# Altium project Flyback-Converter.PrjPcb
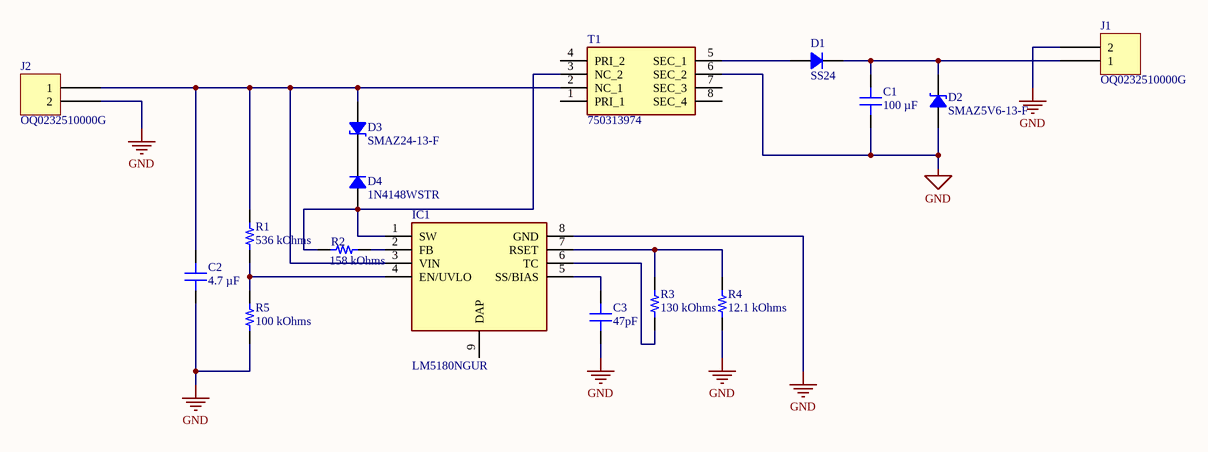
[diagram p0: Flyback-Converter_sch.SchDoc]
1 sheet, 16 parts. Net scope: global (net labels, ports and power ports of the same name join across sheets).
Board file: Flyback-Converter_pcb.PcbDoc

## Sheet Flyback-Converter_sch.SchDoc
size A4; SheetNumber: 1; SheetTotal: 1

### Parts
C1  100 µF  [CAP 1210_3225 - 1MM]
C2  4.7 µF  [CAP 1210_3225 - 1MM]
C3  47pF  [CAP 0402_1005]
D1  SS24  [DO214AA SMB]
D2  SMAZ5V6-13-F  [DO214AC SMA]
D3  SMAZ24-13-F  [DO214AC SMA]
D4  1N4148WSTR  [SOD323F]
IC1  LM5180NGUR  [SON80P400X400X80-9N]
J1  OQ0232510000G  [FCI 06-381-2PIN]
J2  OQ0232510000G  [FCI 06-381-2PIN]
R1  536 kOhms  [RES 0603_1608]
R2  158 kOhms  [RES 0402_1005]
R3  130 kOhms  [RES 0402_1005]
R4  12.1 kOhms  [RES 0402_1005]
R5  100 kOhms  [RES 0402_1005]
T1  750313974  [750313445]

### Nets
GND: C1.1 C2.1 C3.1 D2.1 IC1.8(GND) J1.2 J2.2 R4.1 R5.1 T1.6(SEC_2)
NetC1_2: C1.2 D1.2 D2.2 J1.1
NetC2_2: C2.2 D3.1 IC1.3(VIN) J2.1 R1.2 T1.2(NC_1)
NetC3_2: C3.2 IC1.5(SS/BIAS)
NetD1_1: D1.1 T1.5(SEC_1)
NetD3_2: D3.2 D4.2
NetD4_1: D4.1 IC1.1(SW) R2.2 T1.3(NC_2)
NetIC1_2: IC1.2(FB) R2.1
NetIC1_4: IC1.4(EN/UVLO) R1.1 R5.2
NetIC1_6: IC1.6(TC) R3.1
NetIC1_7: IC1.7(RSET) R3.2 R4.2

Not connected (* = marked no-connect by the designer): IC1 9(DAP); T1 1(PRI_1) 4(PRI_2) 7(SEC_3) 8(SEC_4)

### Library data of the parts
C1 = GRM32EC70J107ME15L: CAP CER 100UF 6.3V X7S 1210; manufacturer: Murata Electronics; Tolerance: ±20%; Part Number: GRM32EC70J107ME15L; Value: 100 µF; Applications: General Purpose; Capacitance: 100 µF; componentlink1description: Datasheet; componentlink1url: https://search.murata.co.jp/Ceramy/image/img/A01X/G101/ENG/GRM32EC70J107ME15-01.pdf; componentlink2description: DigiKey Link; componentlink2url: https://www.digikey.com/en/products/detail/murata-electronics/GRM32EC70J107ME15L/5027614; Device Package: 1210 (3225 Metric); lastupdated: 5.02.2024 20:41:28; Lifecycle Status: Active; Minimum Order: 1; Mounting Type: Surface Mount, MLCC; Operating Temperature: -55°C ~ 125°C; Package / Case: 1210 (3225 Metric); packaging: TapeAndReel; partid: 23659; Part Status: Active; price: 0.15; series: GRM; Size / Dimension: 0.126" L x 0.098" W (3.20mm x 2.50mm); Supplier 1: DigiKey; Supplier Part Number 1: 490-10530-1-ND; Temperature Coefficient: X7S; Thickness (Max): 0.106" (2.70mm); Voltage - Rated: 6.3V
C2 = HMK325BJ475KM-PE: CAP CER 4.7UF 100V X5R 1210; manufacturer: Taiyo Yuden; Tolerance: ±10%; Part Number: HMK325BJ475KM-PE; Value: 4.7 µF; Applications: SMPS Filtering; Capacitance: 4.7 µF; componentlink1description: Datasheet; componentlink1url: http://www.yuden.co.jp/productdata/catalog/mlcc06_e.pdf; componentlink2description: DigiKey Link; componentlink2url: https://www.digikey.com/en/products/detail/taiyo-yuden/HMK325BJ475KM-PE/6563627; Device Package: 1210 (3225 Metric); lastupdated: 5.02.2024 20:41:27; Lifecycle Status: Active; Minimum Order: 1; Mounting Type: Surface Mount, MLCC; Operating Temperature: -55°C ~ 85°C; Package / Case: 1210 (3225 Metric); packaging: TapeAndReel; partid: 23699; Part Status: Active; price: 0.28; series: M; Size / Dimension: 0.126" L x 0.098" W (3.20mm x 2.50mm); Supplier 1: DigiKey; Supplier Part Number 1: 587-5034-1-ND; Temperature Coefficient: X5R; Thickness (Max): 0.106" (2.70mm); Voltage - Rated: 100V
C3 = 04025A470GAT2A: CAP CER 47PF 50V NP0 0402; manufacturer: AVX Corporation; Temperature Coefficient: C0G, NP0; Tolerance: ±2%; Part Number: 04025A470GAT2A; Value: 47pF; Applications: General Purpose; Capacitance: 47pF; componentlink1description: Datasheet; componentlink1url: http://datasheets.avx.com/C0GNP0-Dielectric.pdf; componentlink2description: DigiKey Link; componentlink2url: http://digikey.com/product-detail/en/avx-corporation/04025A470GAT2A/478-10106-1-ND/6797138; Device Package: 0402 (1005 Metric); lastupdated: 8.02.2022 12:26:40; Lifecycle Status: Active; Minimum Order: 1; Mounting Type: Surface Mount, MLCC; Operating Temperature: -55°C ~ 125°C; Package / Case: 0402 (1005 Metric); packaging: TapeAndReel; partid: 11871; Part Status: Active; price: 0.02; series: -; Size / Dimension: 0.039" L x 0.020" W (1.00mm x 0.50mm); Supplier 1: DigiKey; Supplier Part Number 1: 478-10106-1-ND; Thickness (Max): 0.022" (0.56mm); Voltage - Rated: 50V
D1 = SS24: DIODE SCHOTTKY 40V 2A DO214AA; Manufacturer: ON Semiconductor; Current - Reverse Leakage @ Vr: 400µA @ 40V; Speed: Fast Recovery =< 500ns, > 200mA (Io); Voltage - Forward (Vf) (Max) @ If: 500mV @ 2A; Part Number: SS24; ComponentLink1Description: Datasheet; ComponentLink1URL: https://www.onsemi.com/pub/Collateral/SS29-D.pdf; ComponentLink2Description: DigiKey Link; ComponentLink2URL: http://digikey.com/product-detail/en/on-semiconductor/SS24/SS24FSCT-ND/1626273; Current - Average Rectified (Io): 2A; Diode Type: Schottky; LastUpdated: 5.02.2024 21:25:28; Lifecycle Status: Active; Minimum Order: 1; Mounting Type: Surface Mount; Operating Temperature - Junction: -65°C ~ 125°C; Package / Case: DO-214AA, SMB; Packaging: TapeAndReel; PartId: 1394; Part Status: Active; Price: 0.10; Series: -; Supplier 1: DigiKey; Supplier Part Number 1: SS24FSCT-ND; Supplier Device Package: DO-214AA (SMB); Voltage - DC Reverse (Vr) (Max): 40V
D2 = SMAZ5V6-13-F: DIODE ZENER 5.6V 1W SMA; Manufacturer: Diodes Incorporated; Current - Reverse Leakage @ Vr: 5 µA @ 2 V; Impedance (Max) (Zzt): 2 Ohms; Tolerance: ±5%; Voltage - Forward (Vf) (Max) @ If: 1.2 V @ 200 mA; Part Number: SMAZ5V6-13-F; ComponentLink1Description: Datasheet; ComponentLink1URL: https://www.diodes.com/assets/Datasheets/ds18015.pdf; ComponentLink2Description: DigiKey Link; ComponentLink2URL: https://www.digikey.com/en/products/detail/diodes-incorporated/SMAZ5V6-13-F/755466; LastUpdated: 5.02.2024 21:26:52; Lifecycle Status: Active; Minimum Order: 1; Mounting Type: Surface Mount; Operating Temperature: -65°C ~ 150°C; Package / Case: DO-214AC, SMA; Packaging: TapeAndReel; PartId: 1514; Part Status: Active; Power - Max: 1 W; Price: 0.07; Series: -; Supplier 1: DigiKey; Supplier Part Number 1: SMAZ5V6-FDICT-ND; Supplier Device Package: SMA; Voltage - Zener (Nom) (Vz): 5.6 V
D3 = SMAZ24-13-F: DIODE ZENER 24V 1W SMA; Manufacturer: Diodes Incorporated; Current - Reverse Leakage @ Vr: 500 nA @ 18.2 V; Impedance (Max) (Zzt): 15 Ohms; Tolerance: ±5%; Voltage - Forward (Vf) (Max) @ If: 1.2 V @ 200 mA; Part Number: SMAZ24-13-F; ComponentLink1Description: Datasheet; ComponentLink1URL: https://www.diodes.com/assets/Datasheets/ds18015.pdf; ComponentLink2Description: DigiKey Link; ComponentLink2URL: https://www.digikey.com/en/products/detail/diodes-incorporated/SMAZ24-13-F/765429; LastUpdated: 5.02.2024 21:26:52; Lifecycle Status: Active; Minimum Order: 1; Mounting Type: Surface Mount; Operating Temperature: -65°C ~ 150°C; Package / Case: DO-214AC, SMA; Packaging: TapeAndReel; PartId: 1516; Part Status: Active; Power - Max: 1 W; Price: 0.07; Series: -; Supplier 1: DigiKey; Supplier Part Number 1: SMAZ24-FDICT-ND; Supplier Device Package: SMA; Voltage - Zener (Nom) (Vz): 24 V
D4 = 1N4148WSTR: DIODE GEN PURP 75V 300MA SOD323; Manufacturer: SMC Diode Solutions; Capacitance @ Vr, F: 2pF @ 0V, 1MHz; Current - Average Rectified (Io): 300mA (DC); Current - Reverse Leakage @ Vr: 2.5 µA @ 75 V; Diode Type: Standard; Reverse Recovery Time (trr): 4 ns; Speed: Fast Recovery =< 500ns, > 200mA (Io); Voltage - Forward (Vf) (Max) @ If: 1 V @ 300 mA; Part Number: 1N4148WSTR; ComponentLink1Description: Datasheet; ComponentLink1URL: http://www.smc-diodes.com/propdf/1N4148WS%20N0572%20REV.B.pdf; ComponentLink2Description: DigiKey Link; ComponentLink2URL: https://www.digikey.com/en/products/detail/smc-diode-solutions/1N4148WSTR/6022449; LastUpdated: 5.02.2024 21:26:30; Lifecycle Status: Active; Minimum Order: 1; Mounting Type: Surface Mount; Operating Temperature - Junction: -65°C ~ 100°C; Package / Case: SC-90, SOD-323F; Packaging: TapeAndReel; PartId: 1177; Part Status: Active; Price: 0.02; Series: -; Supplier 1: DigiKey; Supplier Part Number 1: 1655-1359-1-ND; Supplier Device Package: SOD-323; Voltage - DC Reverse (Vr) (Max): 75 V
IC1 = LM5180NGUR: Integrated Circuit; Manufacturer_Name: Texas Instruments; Datasheet Link: http://www.ti.com/lit/gpn/LM5180; Height: 0.8mm; Manufacturer_Part_Number: LM5180NGUR; Mouser Part Number: 595-LM5180NGUR; Mouser Price/Stock: https://www.mouser.co.uk/ProductDetail/Texas-Instruments/LM5180NGUR?qs=PqoDHHvF64%2Ft041UjBZcnw%3D%3D; Arrow Part Number: LM5180NGUR; Arrow Price/Stock: https://www.arrow.com/en/products/lm5180ngur/texas-instruments?region=nac
J1 J2 = OQ0232510000G: TERM BLOCK HDR 2POS 90DEG 3.81MM; Manufacturer: Amphenol Anytek; Current - UL: 10A; Header Orientation: 90°, Right Angle; Number of Levels: 1; Number of Positions: 2; Pitch: 0.150" (3.81mm); Voltage - UL: 300V; Part Number: OQ0232510000G; Color: Green; ComponentLink1Description: Datasheet; ComponentLink1URL: http://portal.fciconnect.com/Comergent//fci/drawing/oqxx32x100j0g.pdf; ComponentLink2Description: DigiKey Link; ComponentLink2URL: //digikey.com/product-detail/en/amphenol-anytek/OQ0232510000G/609-3819-ND/2261255; Contact Mating Finish: Tin; LastUpdated: 16.12.2019 19:14:30; Lifecycle Status: 0; Minimum Order: 1; Mounting Type: Through Hole; Operating Temperature: -40°C ~ 115°C; Packaging: Bulk; Part Status: Active; Positions Per Level: 2; Price: 0.49; Series: 06-381; Supplier 1: DigiKey; Supplier Part Number 1: 609-3819-ND; Termination Style: Solder; Type: Header, Male Pins, Shrouded (4 Side)
R1 = CPF0603B536KE1: RES 536 KOHM 0.1% 1/16W 0603; Manufacturer: TE Connectivity Passive Product; Power (Watts): 0.063W, 1/16W; Temperature Coefficient: ±25ppm/°C; Part Number: CPF0603B536KE1; Value: 536 kOhms; ComponentLink2Description: DigiKey Link; ComponentLink2URL: https://www.digikey.com/en/products/detail/te-connectivity-passive-product/CPF0603B536KE1/7493596; Composition: Thin Film; Device Package: 0603 (1608 Metric); Height - Seated (Max): 0.022" (0.55mm); LastUpdated: 5.02.2024 20:37:55; Lifecycle Status: Active; Minimum Order: 1; Number of Terminations: 2; Operating Temperature: -55°C ~ 155°C; Package / Case: 0603 (1608 Metric); Packaging: TapeAndReel; PartId: 75687; Part Status: Active; Price: 0.12; Resistance: 536 kOhms; Series: CPF, Neohm; Size / Dimension: 0.061" L x 0.031" W (1.55mm x 0.80mm); Supplier 1: DigiKey; Supplier Part Number 1: 1712-CPF0603B536KE1CT-ND; Supplier Device Package: 0603; Tolerance: ±0.1%
R2 = AC0402FR-07158KL: RES SMD 158K OHM 1% 1/16W 0402; Manufacturer: Yageo; Power (Watts): 0.063W, 1/16W; Temperature Coefficient: ±100ppm/°C; Part Number: AC0402FR-07158KL; Value: 158 kOhms; ComponentLink1Description: Datasheet; ComponentLink1URL: https://www.yageo.com/upload/media/product/productsearch/datasheet/rchip/PYu-AC_51_RoHS_L_9.pdf; ComponentLink2Description: DigiKey Link; ComponentLink2URL: https://www.digikey.com/en/products/detail/yageo/AC0402FR-07158KL/5895082; Composition: Thick Film; Device Package: 0402 (1005 Metric); Features: Automotive AEC-Q200, Moisture Resistant; Height - Seated (Max): 0.015" (0.37mm); LastUpdated: 5.02.2024 20:27:43; Lifecycle Status: Active; Minimum Order: 1; Number of Terminations: 2; Operating Temperature: -55°C ~ 155°C; Package / Case: 0402 (1005 Metric); Packaging: CutTape; PartId: 70450; Part Status: Active; Price: 0.01; Ratings: AEC-Q200; Resistance: 158 kOhms; Series: AC; Size / Dimension: 0.039" L x 0.020" W (1.00mm x 0.50mm); Supplier 1: DigiKey; Supplier Part Number 1: 13-AC0402FR-07158KLCT-ND; Supplier Device Package: 0402; Tolerance: ±1%
R3 = RT0402FRE07130KL: RES SMD 130K OHM 1% 1/16W 0402; Manufacturer: Yageo; Power (Watts): 0.063W, 1/16W; Temperature Coefficient: ±50ppm/°C; Part Number: RT0402FRE07130KL; Value: 130 kOhms; ComponentLink1Description: Datasheet; ComponentLink1URL: https://media.digikey.com/pdf/Data%20Sheets/Yageo%20PDFs/RT.pdf; ComponentLink2Description: DigiKey Link; ComponentLink2URL: https://www.digikey.com/en/products/detail/yageo/RT0402FRE07130KL/1071746; Composition: Thin Film; Device Package: 0402 (1005 Metric); Features: Moisture Resistant; Height - Seated (Max): 0.014" (0.35mm); LastUpdated: 5.02.2024 20:27:53; Lifecycle Status: Active; Minimum Order: 1; Number of Terminations: 2; Operating Temperature: -55°C ~ 155°C; Package / Case: 0402 (1005 Metric); Packaging: TapeAndReel; PartId: 65019; Part Status: Active; Price: 0.01; Resistance: 130 kOhms; Series: RT; Size / Dimension: 0.039" L x 0.020" W (1.00mm x 0.50mm); Supplier 1: DigiKey; Supplier Part Number 1: 13-RT0402FRE07130KLCT-ND; Supplier Device Package: 0402; Tolerance: ±1%
R4 = RC0402FR-1012K1L: RES 12.1K OHM 1% 1/16W 0402; Manufacturer: Yageo; Power (Watts): 0.063W, 1/16W; Temperature Coefficient: ±100ppm/°C; Part Number: RC0402FR-1012K1L; Value: 12.1 kOhms; ComponentLink1Description: Datasheet; ComponentLink1URL: https://www.yageo.com/upload/media/product/productsearch/datasheet/rchip/PYu-RC_Group_51_RoHS_L_12.pdf; ComponentLink2Description: DigiKey Link; ComponentLink2URL: https://www.digikey.com/en/products/detail/yageo/RC0402FR-1012K1L/17020868; Composition: Thick Film; Device Package: 0402 (1005 Metric); Features: Moisture Resistant; Height - Seated (Max): 0.016" (0.40mm); LastUpdated: 5.02.2024 20:27:23; Lifecycle Status: Active; Minimum Order: 1; Number of Terminations: 2; Operating Temperature: -55°C ~ 155°C; Package / Case: 0402 (1005 Metric); Packaging: CutTape; PartId: 83592; Price: 0.01; Resistance: 12.1 kOhms; Series: RC_L; Size / Dimension: 0.039" L x 0.020" W (1.00mm x 0.50mm); Supplier 1: DigiKey; Supplier Part Number 1: 13-RC0402FR-1012K1LCT-ND; Supplier Device Package: 0402; Tolerance: ±1%
R5 = CRCW0402100KJNEDIF: RES SMD 100K OHM 5% 1/16W 0402; Manufacturer: Vishay Dale; Power (Watts): 0.063W, 1/16W; Temperature Coefficient: ±200ppm/°C; Part Number: CRCW0402100KJNEDIF; Value: 100 kOhms; ComponentLink1Description: Datasheet; ComponentLink1URL: https://www.vishay.com/docs/20024/dcrcwife3.pdf; ComponentLink2Description: DigiKey Link; ComponentLink2URL: https://www.digikey.com/en/products/detail/vishay-dale/CRCW0402100KJNEDIF/3477259; Composition: Thick Film; Device Package: 0402 (1005 Metric); Features: Automotive AEC-Q200, Pulse Withstanding; Height - Seated (Max): 0.016" (0.40mm); LastUpdated: 5.02.2024 20:27:27; Lifecycle Status: Active; Minimum Order: 1; Number of Terminations: 2; Operating Temperature: -55°C ~ 155°C; Package / Case: 0402 (1005 Metric); Packaging: TapeAndReel; PartId: 81823; Price: 0.04; Ratings: AEC-Q200; Resistance: 100 kOhms; Series: CRCW-IF; Size / Dimension: 0.039" L x 0.020" W (1.00mm x 0.50mm); Supplier 1: DigiKey; Supplier Part Number 1: 541-100KATCT-ND; Supplier Device Package: 0402; Tolerance: ±5%
T1 = 750313974: Transformer; Manufacturer_Name: Wurth Elektronik; Datasheet Link: https://katalog.we-online.de/ctm/datasheet/750313974.pdf; Height: 11.43mm; Manufacturer_Part_Number: 750313974; Mouser Part Number: 710-750313974; Mouser Price/Stock: https://www.mouser.co.uk/ProductDetail/Wurth-Elektronik/750313974?qs=x30FU183Eu532zXeh%2Fnknw%3D%3D